# Altium schematic sheet Car.SchDoc
size A2
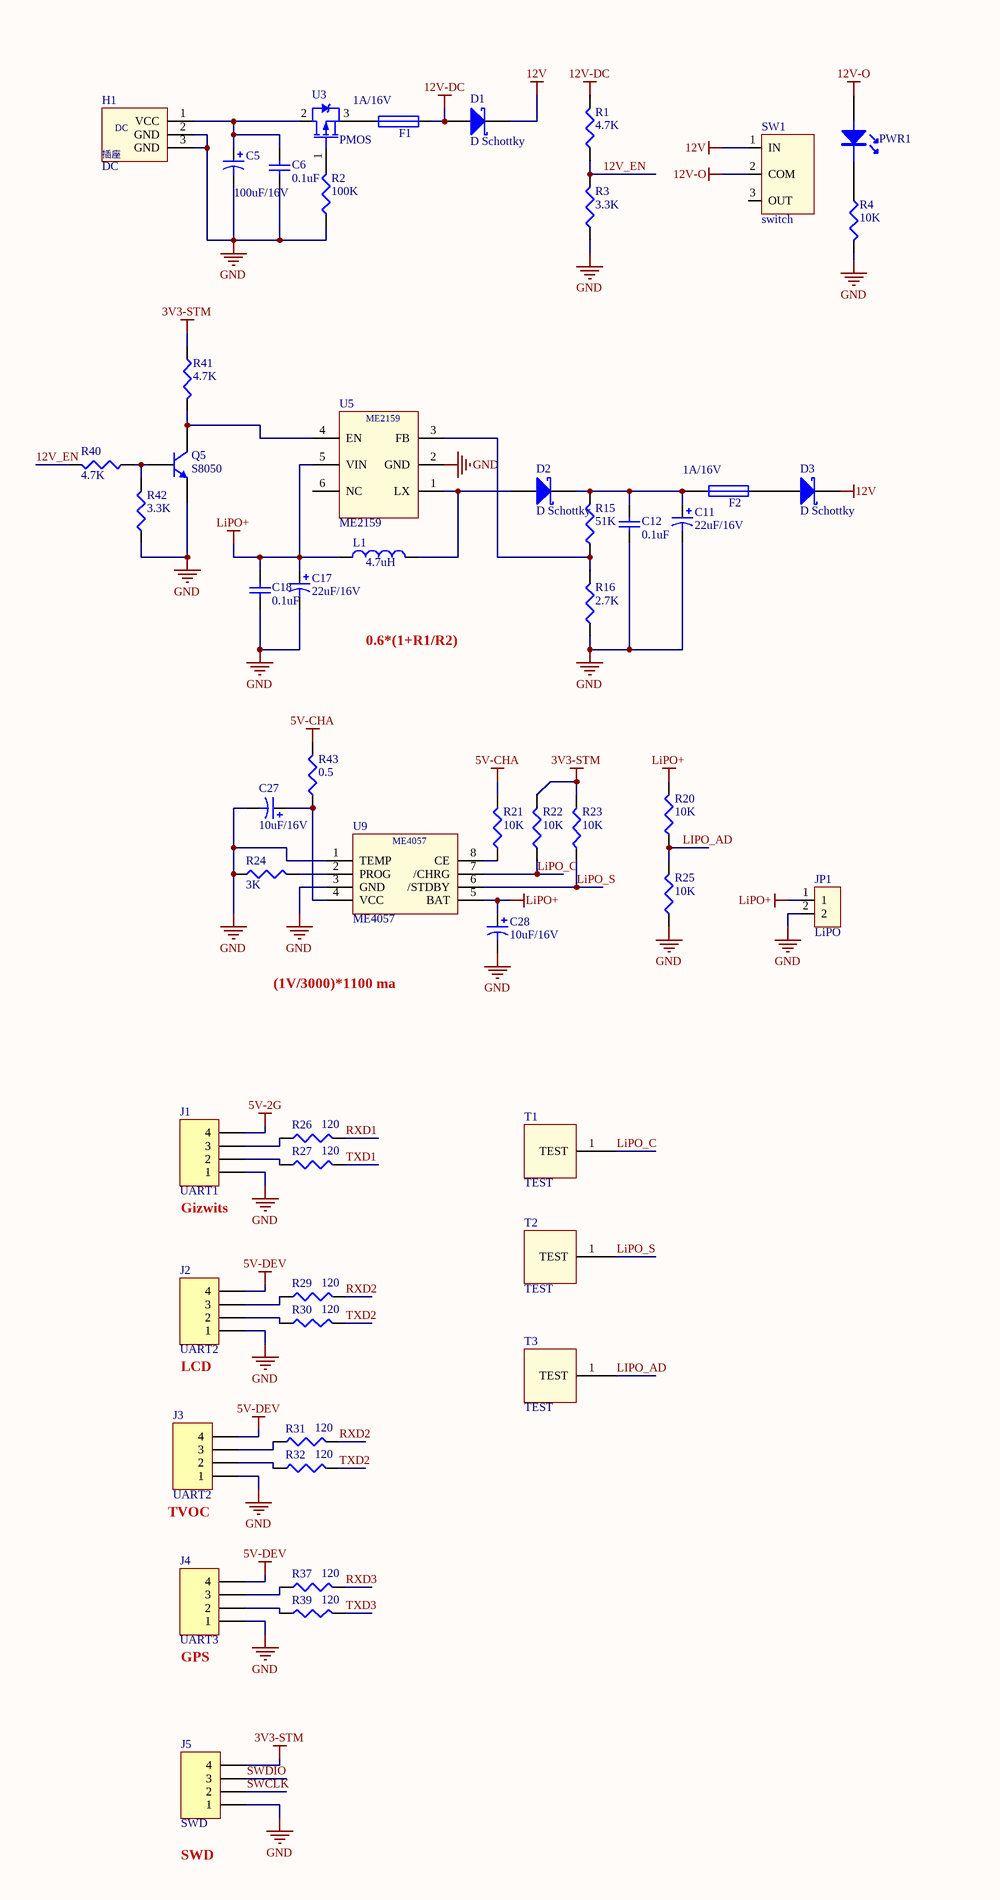
[diagram p0: Car.SchDoc, left]
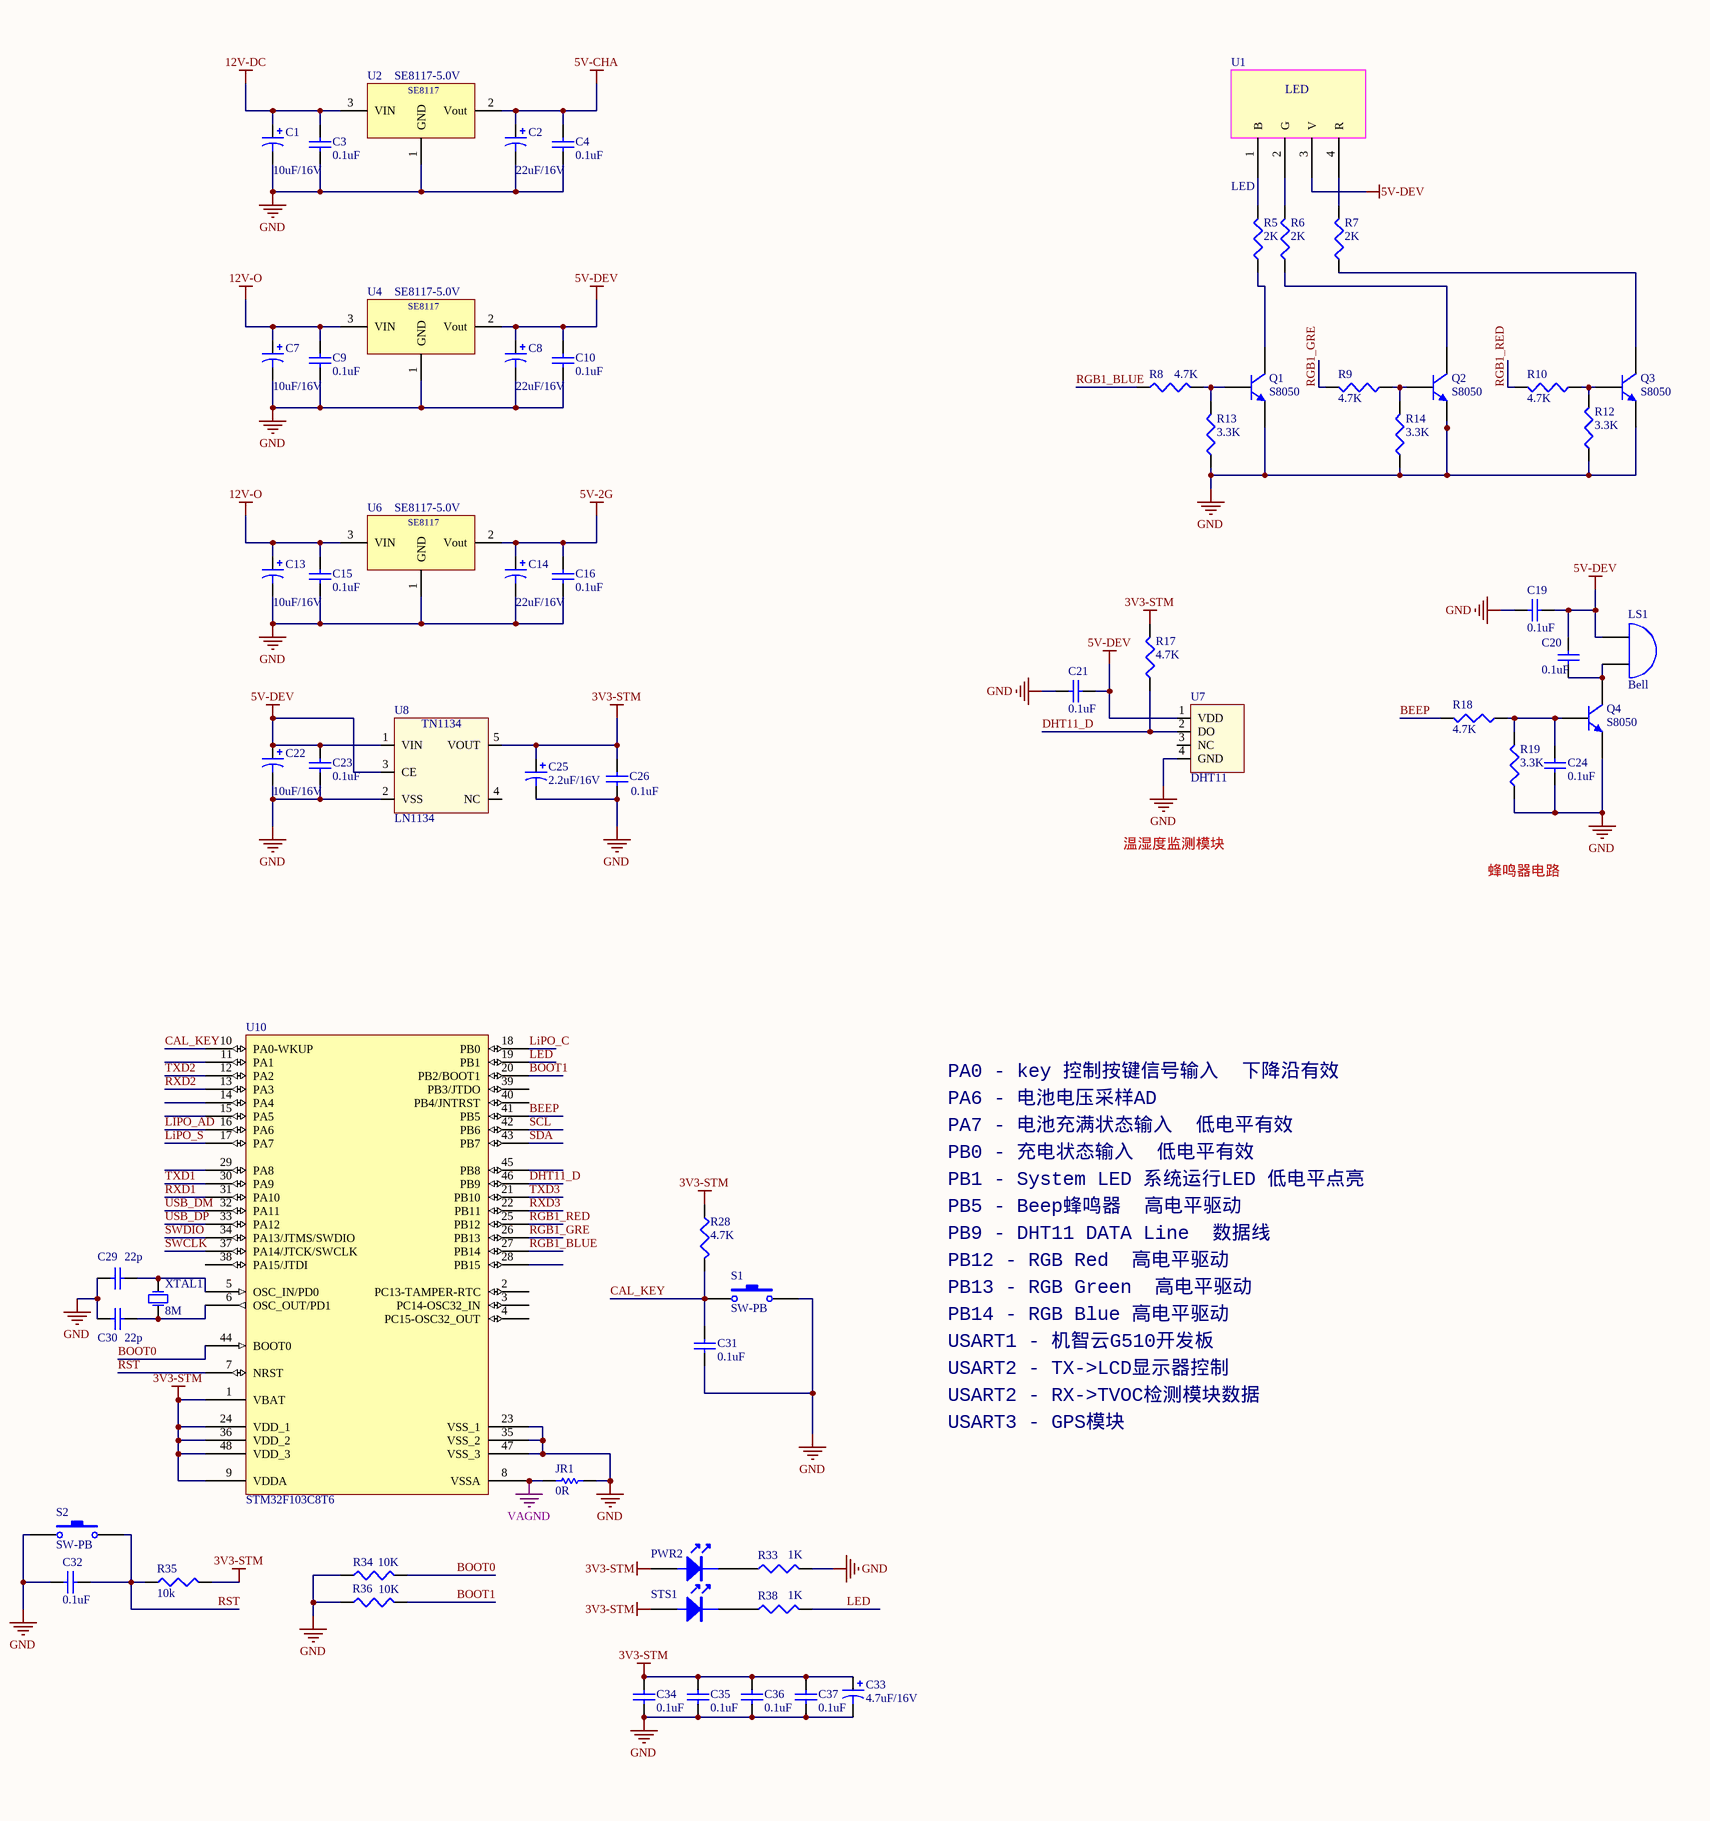
[diagram p1: Car.SchDoc, right]

## Parts
C1  10uF/16V  [C1206C]
C2  22uF/16V  [C1206C]
C3  0.1uF  [C0603B]
C4  0.1uF  [C0603B]
C5  100uF/16V  [CAP_6.3*7]
C6  0.1uF  [C0603B]
C7  10uF/16V  [C1206C]
C8  22uF/16V  [C1206C]
C9  0.1uF  [C0603B]
C10  0.1uF  [C0603B]
C11  22uF/16V  [C1206C]
C12  0.1uF  [C0603B]
C13  10uF/16V  [C1206C]
C14  22uF/16V  [C1206C]
C15  0.1uF  [C0603B]
C16  0.1uF  [C0603B]
C17  22uF/16V  [C1206C]
C18  0.1uF  [C0603B]
C19  0.1uF  [C0603B]
C20  0.1uF  [C0603B]
C21  0.1uF  [C0603B]
C22  10uF/16V  [C1206C]
C23  0.1uF  [C0603B]
C24  0.1uF  [C0603B]
C25  2.2uF/16V  [C1206C]
C26  0.1uF  [C0603B]
C27  10uF/16V  [C1206C]
C28  10uF/16V  [C1206C]
C29  22p  [C0603B]
C30  22p  [C0603B]
C31  0.1uF  [C0603B]
C32  0.1uF  [C0603B]
C33  4.7uF/16V  [C1206C]
C34  0.1uF  [C0603B]
C35  0.1uF  [C0603B]
C36  0.1uF  [C0603B]
C37  0.1uF  [C0603B]
D1  D Schottky  [DO-214AC]
D2  D Schottky  [DO-214AC]
D3  D Schottky  [DO-214AC]
F1  1A/16V  [LC-1206_L]
F2  1A/16V  [LC-1206_L]
H1  DC  [DC_2.1]
J1  UART1  [SIPA4-1.27-SMT-H]
J2  UART2  [SIPA4-1.27-SMT-H]
J3  UART2  [SIPA4-1.27-SMT-H]
J4  UART3  [SIPA4-1.27-SMT-H]
J5  SWD  [SIP4-1.27]
JP1  LiPO  [LiPO_2PIN]
JR1  0R  [0JUMP0603]
L1  value 4.7uH  [L-6X6X3]  (hidden comment: Inductor)
LS1  Bell  [BEEP12*7.5]
PWR1  LED  [LED0805R]  (value not drawn)
PWR2  LED  [LED0805R]  (value not drawn)
Q1  S8050  [SOT-23-3]
Q2  S8050  [SOT-23-3]
Q3  S8050  [SOT-23-3]
Q4  S8050  [SOT-23-3]
Q5  S8050  [SOT-23-3]
R1  4.7K  [R0603B]
R2  100K  [R0603B]
R3  3.3K  [R0603B]
R4  10K  [R0603B]
R5  2K  [R0603B]
R6  2K  [R0603B]
R7  2K  [R0603B]
R8  4.7K  [R0603B]
R9  4.7K  [R0603B]
R10  4.7K  [R0603B]
R12  3.3K  [R0603B]
R13  3.3K  [R0603B]
R14  3.3K  [R0603B]
R15  51K  [R0603B]
R16  2.7K  [R0603B]
R17  4.7K  [R0603B]
R18  4.7K  [R0603B]
R19  3.3K  [R0603B]
R20  10K  [R0603B]
R21  10K  [R0603B]
R22  10K  [R0603B]
R23  10K  [R0603B]
R24  3K  [R0603B]
R25  10K  [R0603B]
R26  120  [R0603B]
R27  120  [R0603B]
R28  4.7K  [R0603B]
R29  120  [R0603B]
R30  120  [R0603B]
R31  120  [R0603B]
R32  120  [R0603B]
R33  1K  [R0603B]
R34  10K  [R0603B]
R35  10k  [R0603B]
R36  10K  [R0603B]
R37  120  [R0603B]
R38  1K  [R0603B]
R39  120  [R0603B]
R40  4.7K  [R0603B]
R41  4.7K  [R0603B]
R42  3.3K  [R0603B]
R43  0.5  [R2010]
S1  SW-PB  [ce_switch_4.5*4.5*4.8]
S2  SW-PB  [ce_switch_4.5*4.5*4.8]
STS1  LED  [LED0805G]  (value not drawn)
SW1  switch  [SW_SK-12E12]
T1  TEST  [TEST_POINT]
T2  TEST  [TEST_POINT]
T3  TEST  [TEST_POINT]
U1  LED  [5MM-LED]
U2  SE8117-5.0V  [LC-SOT-223]
U3  PMOS  [SOT-23-3]
U4  SE8117-5.0V  [LC-SOT-223]
U5  ME2159  [LC-SOT-23-6]
U6  SE8117-5.0V  [LC-SOT-223]
U7  DHT11  [DHT11-4PIN]
U8  LN1134  [LC-SOT-23-5]
U9  ME4057  [LC-SOP-8_EP_150mil]
U10  STM32F103C8T6  [LQFP48_M_STM32]
XTAL1  8M  [XL5032]

## Nets
3V3-STM: C25.1 C26.1 C33.1 C34.2 C35.2 C36.2 C37.2 J5.4 PWR2.1 R17.2 R22.2 R23.2 R28.1 R35.1 R41.1 STS1.1 U8.5(VOUT) U10.1(VBAT) U10.9(VDDA) U10.24(VDD_1) U10.36(VDD_2) U10.48(VDD_3)
5V-2G: C14.1 C16.2 J1.4 U6.2(Vout)
5V-CHA: C2.1 C4.2 R21.2 R43.2 U2.2(Vout)
5V-DEV: C8.1 C10.2 C19.2 C20.2 C21.2 C22.1 C23.2 J2.4 J3.4 J4.4 LS1.1(A) U1.3(V) U4.2(Vout) U7.1(VDD) U8.1(VIN) U8.3(CE)
12V: D1.2(K) D3.2(K) SW1.1(IN)
12V-DC: C1.1 C3.2 D1.1(A) F1.2 R1.2 U2.3(VIN)
12V-O: C7.1 C9.2 C13.1 C15.2 PWR1.1 SW1.2(COM) U4.3(VIN) U6.3(VIN)
GND: C1.2 C2.2 C3.1 C4.1 C5.2 C6.1 C7.2 C8.2 C9.1 C10.1 C11.2 C12.1 C13.2 C14.2 C15.1 C16.1 C17.2 C18.1 C19.1 C21.1 C22.2 C23.1 C24.1 C25.2 C26.2 C27.2 C28.2 C29.2 C30.2 C31.1 C32.1 C33.2 C34.1 C35.1 C36.1 C37.1 H1.2(GND) H1.3(GND) J1.1 J2.1 J3.1 J4.1 J5.1 JP1.2 JR1.2 Q1.3(E) Q2.3(E) Q3.3(E) Q4.3(E) Q5.3(E) R2.1 R3.1 R4.2 R12.1 R13.1 R14.1 R16.1 R19.1 R24.1 R25.1 R33.2 R34.1 R36.1 R42.1 S1.2 S2.1 U2.1(GND) U4.1(GND) U5.2(GND) U6.1(GND) U7.4(GND) U8.2(VSS) U9.1(TEMP) U9.3(GND) U10.23(VSS_1) U10.35(VSS_2) U10.47(VSS_3)
LiPO+: C17.1 C18.2 C28.1 JP1.1 L1.1 R20.2 U5.5(VIN) U9.5(BAT)
VAGND: JR1.1 U10.8(VSSA)
12V_EN: R1.1 R3.2 R40.2
BEEP: R18.2 U10.41(PB5)
BOOT0: R34.2 U10.44(BOOT0)
BOOT1: R36.2 U10.20(PB2/BOOT1)
CAL_KEY: C31.2 R28.2 S1.1 U10.10(PA0-WKUP)
DHT11_D: R17.1 U7.2(DO) U10.46(PB9)
LED: R38.2 U10.19(PB1)
LIPO_AD: R20.1 R25.2 T3.1(TEST) U10.16(PA6)
LiPO_C: R22.1 T1.1(TEST) U9.7(/CHRG) U10.18(PB0)
LiPO_S: R23.1 T2.1(TEST) U9.6(/STDBY) U10.17(PA7)
RGB1_BLUE: R8.1 U10.27(PB14)
RGB1_GRE: R9.2 U10.26(PB13)
RGB1_RED: R10.2 U10.25(PB12)
RST: C32.2 R35.2 S2.2 U10.7(NRST)
RXD1: R26.2 U10.31(PA10)
RXD2: R29.2 R31.2 U10.13(PA3)
RXD3: R37.2 U10.22(PB11)
SCL: U10.42(PB6)
SDA: U10.43(PB7)
SWCLK: J5.2 U10.37(PA14/JTCK/SWCLK)
SWDIO: J5.3 U10.34(PA13/JTMS/SWDIO)
TXD1: R27.2 U10.30(PA9)
TXD2: R30.2 R32.2 U10.12(PA2)
TXD3: R39.2 U10.21(PB10)
USB_DM: U10.32(PA11)
USB_DP: U10.33(PA12)
NetC5_1: C5.1 C6.2 H1.1(VCC) U3.2(D)
NetC11_1: C11.1 C12.2 D2.2(K) F2.1 R15.2
NetC20_1: C20.1 LS1.2(B) Q4.2(C)
NetC24_2: C24.2 Q4.1(B) R18.1 R19.2
NetC27_1: C27.1 R43.1 U9.4(VCC)
NetC29_1: C29.1 U10.5(OSC_IN/PD0) XTAL1.2(OSC2)
NetC30_1: C30.1 U10.6(OSC_OUT/PD1) XTAL1.1(OSC1)
NetD2_1: D2.1(A) L1.2 U5.1(LX)
NetD3_1: D3.1(A) F2.2
NetF1_1: F1.1 U3.3(S)
NetJ1_2: J1.2 R27.1
NetJ1_3: J1.3 R26.1
NetJ2_2: J2.2 R30.1
NetJ2_3: J2.3 R29.1
NetJ3_2: J3.2 R32.1
NetJ3_3: J3.3 R31.1
NetJ4_2: J4.2 R39.1
NetJ4_3: J4.3 R37.1
NetPWR1_2: PWR1.2 R4.1
NetPWR2_2: PWR2.2 R33.1
NetQ1_1: Q1.1(B) R8.2 R13.2
NetQ1_2: Q1.2(C) R5.1
NetQ2_1: Q2.1(B) R9.1 R14.2
NetQ2_2: Q2.2(C) R6.1
NetQ3_1: Q3.1(B) R10.1 R12.2
NetQ3_2: Q3.2(C) R7.1
NetQ5_1: Q5.1(B) R40.1 R42.2
NetQ5_2: Q5.2(C) R41.2 U5.4(EN)
NetR2_2: R2.2 U3.1(G)
NetR5_2: R5.2 U1.1(B)
NetR6_2: R6.2 U1.2(G)
NetR7_2: R7.2 U1.4(R)
NetR15_1: R15.1 R16.2 U5.3(FB)
NetR21_1: R21.1 U9.8(CE)
NetR24_2: R24.2 U9.2(PROG)
NetR38_1: R38.1 STS1.2

Not connected (* = marked no-connect by the designer): SW1 3(OUT); U5 6(NC); U7 3(NC); U8 4(NC); U10 2(PC13-TAMPER-RTC) 3(PC14-OSC32_IN) 4(PC15-OSC32_OUT) 11(PA1) 14(PA4) 15(PA5) 28(PB15) 29(PA8) 38(PA15/JTDI) 39(PB3/JTDO) 40(PB4/JNTRST) 45(PB8)

## Notes on the sheet
- 0.6*(1+R1/R2)
- 温湿度监测模块
- 蜂鸣器电路
- (1V/3000)*1100 ma
- PA0 - key 控制按键信号输入  下降沿有效
- PA6 - 电池电压采样AD
- PA7 - 电池充满状态输入  低电平有效
- PB1 - System LED 系统运行LED 低电平点亮
- PB0 - 充电状态输入  低电平有效
- (near J1) Gizwits
- PB5 - Beep蜂鸣器  高电平驱动
- PB9 - DHT11 DATA Line  数据线
- PB12 - RGB Red  高电平驱动
- PB13 - RGB Green  高电平驱动
- PB14 - RGB Blue 高电平驱动
- (near J2) LCD
- USART1 - 机智云G510开发板
- USART2 - TX->LCD显示器控制
- USART2 - RX->TVOC检测模块数据
- USART3 - GPS模块
- (near J3) TVOC
- (near J4) GPS
- (near J5) SWD
- (in symbol DC2.1mm) 插座
- (in symbol LN1134) TN1134

## Library data of the parts
C1 C2 C5 C7 C8 C11 C13 C14 C17 C22 C25 C27 C28 = Cap Pol1: Polarized Capacitor (Radial); Value: 1uF/16V; Published: 8-Jun-2000; LatestRevisionDate: 17-Jul-2002; LatestRevisionNote: Re-released for DXP Platform.; PackageReference: RB7.6-15; Publisher: Altium Limited
C3 C4 C6 C9 C10 C12 C15 C16 C18-C21 C23 C24 C26 C31 C32 C34-C37 = Cap: Capacitor; Published: 8-Jun-2000; LatestRevisionDate: 17-Jul-2002; LatestRevisionNote: Re-released for DXP Platform.; PackageReference: RAD-0.3; Publisher: Altium Limited; Value: 0.1uF
C29 C30 = Cap: Capacitor; Value: 22pF; Published: 8-Jun-2000; LatestRevisionDate: 17-Jul-2002; LatestRevisionNote: Re-released for DXP Platform.; PackageReference: RAD-0.3; Publisher: Altium Limited
C33 = Cap Pol1: Polarized Capacitor (Radial); Published: 8-Jun-2000; LatestRevisionDate: 17-Jul-2002; LatestRevisionNote: Re-released for DXP Platform.; PackageReference: RB7.6-15; Publisher: Altium Limited; Value: 4.7uF/16V
D1-D3 = D Schottky: Schottky Diode; Published: 8-Jun-2000; LatestRevisionDate: 17-Jul-2002; LatestRevisionNote: Re-released for DXP Platform.; PackageReference: SMB; Publisher: Altium Limited; PackageDescription: DO-214-AA/SMB; 2 C-Bend Leads; Body 5.3 x 3.6 mm, inc. leads (LxW); Code_JEDEC: DO-214-AA
F1 F2 = Fuse 1: Fuse; Published: 8-Jun-2000; LatestRevisionDate: 17-Jul-2002; LatestRevisionNote: Re-released for DXP Platform.; PackageReference: PIN-W2/E2.8; Publisher: Altium Limited; PackageDescription: Thru-Hole; 2 Leads
H1 = DC2.1mm: 电池电源插座
J1-J5 = Header 4: Header, 4-Pin; LatestRevisionDate: 17-Jul-2002; LatestRevisionNote: Re-released for DXP Platform.; Publisher: Altium Limited
JP1 = CON2
JR1 = Res1: Resistor; Value: 0; Published: 8-Jun-2000; LatestRevisionDate: 17-Jul-2002; LatestRevisionNote: Re-released for DXP Platform.; PackageReference: AXIAL-0.3; Publisher: Altium Limited; PackageDescription: Axial Device, Thru-Hole; 2 Leads; 0.3 in Pin Spacing
L1 = Inductor: Code_IEC: 1005; Published: 8-Jun-2000; LatestRevisionDate: 29-May-2009; LatestRevisionNote: IPC-7351 Footprint Added.; PackageReference: 0402-A; Publisher: Altium Limited; PackageDescription: Chip Inductor; Code_JEITA: 0402
LS1 = Bell: Electrical Bell; Published: 24-Mar-1999; LatestRevisionDate: 17-Jul-2002; LatestRevisionNote: Re-released for DXP Platform.; PackageReference: PIN2; Publisher: Altium Limited
Q1-Q5 = NPN: NPN Bipolar Transistor; Published: 8-Jun-2000; LatestRevisionDate: 17-Jul-2002; LatestRevisionNote: Re-released for DXP Platform.; PackageReference: TO-226-AA; Publisher: Altium Limited; PackageDescription: TO, Flat Index; 3 In-Line, Axial Leads; Body Dia. 4.8mm; Leads 0.55 x 0.51 mm (max); Code_JEDEC: TO-226-AA
R1-R3 R15-R17 R24 R43 = Res3: Resistor; Value: 10K; Published: 8-Jun-2000; LatestRevisionDate: 29-May-2009; LatestRevisionNote: IPC-7351 Footprint Added.; PackageReference: J1-0603; Publisher: Altium Limited; PackageDescription: Chip Resistor
R4 = Res3: Resistor; Value: 1K; Published: 8-Jun-2000; LatestRevisionDate: 29-May-2009; LatestRevisionNote: IPC-7351 Footprint Added.; PackageReference: J1-0603; Publisher: Altium Limited; PackageDescription: Chip Resistor
R5 R6 = Res3: Resistor; Value: 180; Published: 8-Jun-2000; LatestRevisionDate: 29-May-2009; LatestRevisionNote: IPC-7351 Footprint Added.; PackageReference: J1-0603; Publisher: Altium Limited; PackageDescription: Chip Resistor
R7 = Res3: Resistor; Value: 150; Published: 8-Jun-2000; LatestRevisionDate: 29-May-2009; LatestRevisionNote: IPC-7351 Footprint Added.; PackageReference: J1-0603; Publisher: Altium Limited; PackageDescription: Chip Resistor
R8-R10 R12-R14 R18-R23 R25-R42 = Res3: Resistor; Published: 8-Jun-2000; LatestRevisionDate: 29-May-2009; LatestRevisionNote: IPC-7351 Footprint Added.; PackageReference: J1-0603; Publisher: Altium Limited; PackageDescription: Chip Resistor
  R8-R10 R18 R28 R40 R41: Value: 4.7K
  R12-R14 R19 R42: Value: 3.3K
  R20-R23 R25 R34-R36: Value: 10K
  R26 R27 R29-R32 R37 R39: Value: 120
  R33 R38: Value: 1K
S1 S2 = SW-PB: Switch; Published: 24-Mar-1999; LatestRevisionDate: 17-Jul-2002; LatestRevisionNote: Re-released for DXP Platform.; PackageReference: SPST-2; Publisher: Altium Limited; PackageDescription: Switch; 2 Leads
SW1 = Switch_3
T1-T3 = TEST_POINT
U1 = 5MM-LED
U2 U4 U6 = SE8117: 降压稳压芯片，该系列最大1A输出
U3 = PMOS: 单个PMOS
U5 = ME2159: 单节锂电池升压芯片，最大12V
U8 = LN1134: 3.3V LDO
U9 = ME4057: 单节锂电池充电芯片
U10 = STM32F101C8T6: STM32 ARM-based 32-bit MCU with 64 Kbytes Flash, 48-pin LQFP, Industrial Temperature; Published: 30-May-2008; DatasheetVersion: rev6, Mar-2008; PackageVersion: Mar-2008; PackageReference: LQFP48; Publisher: Altium Limited; PackageDescription: 48-Pin Low-Profile Quad Flat Pack, 7 x 7 mm Body, 0.5 mm Pitch (LQFP48); ComponentLink1Description: Manufacturer Link; ComponentLink1URL: www.st.com/stm32; ComponentLink2Description: Datasheet; ComponentLink2URL: http://www.st.com/stonline/products/literature/ds/13586.pdf
XTAL1 = XTAL: Crystal Oscillator; Published: 8-Jun-2000; LatestRevisionDate: 17-Jul-2002; LatestRevisionNote: Re-released for DXP Platform.; PackageReference: R38; Publisher: Altium Limited